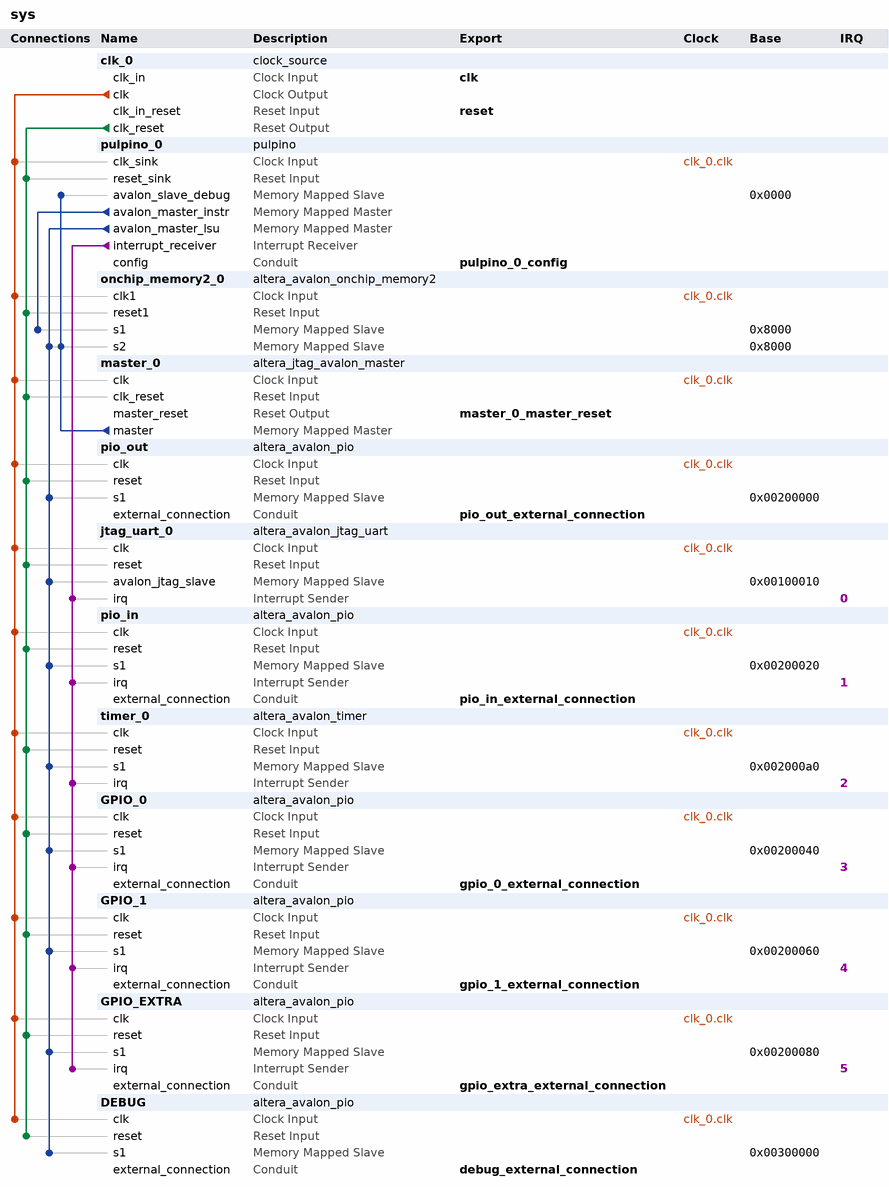
[diagram p0: system contents]
# Platform Designer (Qsys) system sys, Cyclone V 5CSEBA6U23I7
# Parameters at their usual value, and those the tool derives, are not listed.
package require -exact qsys 25.1
create_system sys
set_project_property DEVICE_FAMILY {Cyclone V}
set_project_property DEVICE 5CSEBA6U23I7

add_instance clk_0 clock_source 25.1
set_instance_parameter_value clk_0 clockFrequency 50000000

add_instance pulpino_0 pulpino 1.0
set_instance_parameter_value pulpino_0 AXI_ADDR_WIDTH 32
set_instance_parameter_value pulpino_0 AXI_DATA_WIDTH 32
set_instance_parameter_value pulpino_0 AXI_ID_MASTER_WIDTH 10
set_instance_parameter_value pulpino_0 AXI_ID_SLAVE_WIDTH 10
set_instance_parameter_value pulpino_0 AXI_USER_WIDTH 0
set_instance_parameter_value pulpino_0 RISCY_RV32F false
set_instance_parameter_value pulpino_0 USE_ZERO_RISCY true
set_instance_parameter_value pulpino_0 ZERO_RV32E false
set_instance_parameter_value pulpino_0 ZERO_RV32M true

add_instance onchip_memory2_0 altera_avalon_onchip_memory2 25.1
set_instance_parameter_value onchip_memory2_0 dataWidth 32
set_instance_parameter_value onchip_memory2_0 dualPort true
set_instance_parameter_value onchip_memory2_0 initMemContent true
set_instance_parameter_value onchip_memory2_0 memorySize 32768
set_instance_parameter_value onchip_memory2_0 singleClockOperation true

add_instance master_0 altera_jtag_avalon_master 25.1

add_instance pio_out altera_avalon_pio 25.1
set_instance_parameter_value pio_out direction Output
set_instance_parameter_value pio_out width 32

add_instance jtag_uart_0 altera_avalon_jtag_uart 25.1
set_instance_parameter_value jtag_uart_0 simInteractiveOptions NO_INTERACTIVE_WINDOWS
set_instance_parameter_value jtag_uart_0 useRegistersForReadBuffer true
set_instance_parameter_value jtag_uart_0 useRegistersForWriteBuffer true

add_instance pio_in altera_avalon_pio 25.1
set_instance_parameter_value pio_in captureEdge true
set_instance_parameter_value pio_in direction Input
set_instance_parameter_value pio_in generateIRQ true
set_instance_parameter_value pio_in irqType EDGE
set_instance_parameter_value pio_in width 32

add_instance timer_0 altera_avalon_timer 25.1
set_instance_parameter_value timer_0 period 5000
set_instance_parameter_value timer_0 periodUnits CLOCKS

add_instance GPIO_0 altera_avalon_pio 25.1
set_instance_parameter_value GPIO_0 bitClearingEdgeCapReg true
set_instance_parameter_value GPIO_0 bitModifyingOutReg true
set_instance_parameter_value GPIO_0 captureEdge true
set_instance_parameter_value GPIO_0 direction Bidir
set_instance_parameter_value GPIO_0 generateIRQ true
set_instance_parameter_value GPIO_0 irqType EDGE
set_instance_parameter_value GPIO_0 width 32

add_instance GPIO_1 altera_avalon_pio 25.1
set_instance_parameter_value GPIO_1 bitClearingEdgeCapReg true
set_instance_parameter_value GPIO_1 bitModifyingOutReg true
set_instance_parameter_value GPIO_1 captureEdge true
set_instance_parameter_value GPIO_1 direction Bidir
set_instance_parameter_value GPIO_1 generateIRQ true
set_instance_parameter_value GPIO_1 irqType EDGE
set_instance_parameter_value GPIO_1 width 32

add_instance GPIO_EXTRA altera_avalon_pio 25.1
set_instance_parameter_value GPIO_EXTRA bitClearingEdgeCapReg true
set_instance_parameter_value GPIO_EXTRA bitModifyingOutReg true
set_instance_parameter_value GPIO_EXTRA captureEdge true
set_instance_parameter_value GPIO_EXTRA direction Bidir
set_instance_parameter_value GPIO_EXTRA generateIRQ true
set_instance_parameter_value GPIO_EXTRA irqType EDGE
set_instance_parameter_value GPIO_EXTRA width 8

add_instance DEBUG altera_avalon_pio 25.1
set_instance_parameter_value DEBUG bitModifyingOutReg true
set_instance_parameter_value DEBUG direction Output
set_instance_parameter_value DEBUG width 32

# connections
add_connection clk_0.clk DEBUG.clk clock
add_connection clk_0.clk GPIO_0.clk clock
add_connection clk_0.clk GPIO_1.clk clock
add_connection clk_0.clk GPIO_EXTRA.clk clock
add_connection clk_0.clk jtag_uart_0.clk clock
add_connection clk_0.clk master_0.clk clock
add_connection clk_0.clk onchip_memory2_0.clk1 clock
add_connection clk_0.clk pio_in.clk clock
add_connection clk_0.clk pio_out.clk clock
add_connection clk_0.clk pulpino_0.clk_sink clock
add_connection clk_0.clk timer_0.clk clock
add_connection clk_0.clk_reset DEBUG.reset reset
add_connection clk_0.clk_reset GPIO_0.reset reset
add_connection clk_0.clk_reset GPIO_1.reset reset
add_connection clk_0.clk_reset GPIO_EXTRA.reset reset
add_connection clk_0.clk_reset jtag_uart_0.reset reset
add_connection clk_0.clk_reset master_0.clk_reset reset
add_connection clk_0.clk_reset onchip_memory2_0.reset1 reset
add_connection clk_0.clk_reset pio_in.reset reset
add_connection clk_0.clk_reset pio_out.reset reset
add_connection clk_0.clk_reset pulpino_0.reset_sink reset
add_connection clk_0.clk_reset timer_0.reset reset
add_connection master_0.master onchip_memory2_0.s2 avalon
set_connection_parameter_value master_0.master/onchip_memory2_0.s2 baseAddress 0x8000
add_connection master_0.master pulpino_0.avalon_slave_debug avalon
set_connection_parameter_value master_0.master/pulpino_0.avalon_slave_debug baseAddress 0x0000
add_connection pulpino_0.avalon_master_instr onchip_memory2_0.s1 avalon
set_connection_parameter_value pulpino_0.avalon_master_instr/onchip_memory2_0.s1 baseAddress 0x8000
add_connection pulpino_0.avalon_master_lsu DEBUG.s1 avalon
set_connection_parameter_value pulpino_0.avalon_master_lsu/DEBUG.s1 baseAddress 0x00300000
add_connection pulpino_0.avalon_master_lsu GPIO_0.s1 avalon
set_connection_parameter_value pulpino_0.avalon_master_lsu/GPIO_0.s1 baseAddress 0x00200040
add_connection pulpino_0.avalon_master_lsu GPIO_1.s1 avalon
set_connection_parameter_value pulpino_0.avalon_master_lsu/GPIO_1.s1 baseAddress 0x00200060
add_connection pulpino_0.avalon_master_lsu GPIO_EXTRA.s1 avalon
set_connection_parameter_value pulpino_0.avalon_master_lsu/GPIO_EXTRA.s1 baseAddress 0x00200080
add_connection pulpino_0.avalon_master_lsu jtag_uart_0.avalon_jtag_slave avalon
set_connection_parameter_value pulpino_0.avalon_master_lsu/jtag_uart_0.avalon_jtag_slave baseAddress 0x00100010
add_connection pulpino_0.avalon_master_lsu onchip_memory2_0.s2 avalon
set_connection_parameter_value pulpino_0.avalon_master_lsu/onchip_memory2_0.s2 baseAddress 0x8000
add_connection pulpino_0.avalon_master_lsu pio_in.s1 avalon
set_connection_parameter_value pulpino_0.avalon_master_lsu/pio_in.s1 baseAddress 0x00200020
add_connection pulpino_0.avalon_master_lsu pio_out.s1 avalon
set_connection_parameter_value pulpino_0.avalon_master_lsu/pio_out.s1 baseAddress 0x00200000
add_connection pulpino_0.avalon_master_lsu timer_0.s1 avalon
set_connection_parameter_value pulpino_0.avalon_master_lsu/timer_0.s1 baseAddress 0x002000a0
add_connection pulpino_0.interrupt_receiver GPIO_0.irq interrupt
set_connection_parameter_value pulpino_0.interrupt_receiver/GPIO_0.irq irqNumber 3
add_connection pulpino_0.interrupt_receiver GPIO_1.irq interrupt
set_connection_parameter_value pulpino_0.interrupt_receiver/GPIO_1.irq irqNumber 4
add_connection pulpino_0.interrupt_receiver GPIO_EXTRA.irq interrupt
set_connection_parameter_value pulpino_0.interrupt_receiver/GPIO_EXTRA.irq irqNumber 5
add_connection pulpino_0.interrupt_receiver jtag_uart_0.irq interrupt
set_connection_parameter_value pulpino_0.interrupt_receiver/jtag_uart_0.irq irqNumber 0
add_connection pulpino_0.interrupt_receiver pio_in.irq interrupt
set_connection_parameter_value pulpino_0.interrupt_receiver/pio_in.irq irqNumber 1
add_connection pulpino_0.interrupt_receiver timer_0.irq interrupt
set_connection_parameter_value pulpino_0.interrupt_receiver/timer_0.irq irqNumber 2

# exported interfaces
add_interface clk clock sink
set_interface_property clk EXPORT_OF clk_0.clk_in
add_interface debug_external_connection conduit end
set_interface_property debug_external_connection EXPORT_OF DEBUG.external_connection
add_interface gpio_0_external_connection conduit end
set_interface_property gpio_0_external_connection EXPORT_OF GPIO_0.external_connection
add_interface gpio_1_external_connection conduit end
set_interface_property gpio_1_external_connection EXPORT_OF GPIO_1.external_connection
add_interface gpio_extra_external_connection conduit end
set_interface_property gpio_extra_external_connection EXPORT_OF GPIO_EXTRA.external_connection
add_interface master_0_master_reset reset source
set_interface_property master_0_master_reset EXPORT_OF master_0.master_reset
add_interface pio_in_external_connection conduit end
set_interface_property pio_in_external_connection EXPORT_OF pio_in.external_connection
add_interface pio_out_external_connection conduit end
set_interface_property pio_out_external_connection EXPORT_OF pio_out.external_connection
add_interface pulpino_0_config conduit end
set_interface_property pulpino_0_config EXPORT_OF pulpino_0.config
add_interface reset reset sink
set_interface_property reset EXPORT_OF clk_0.clk_in_reset

set_interconnect_requirement {$system} qsys_mm.clockCrossingAdapter HANDSHAKE
set_interconnect_requirement {$system} qsys_mm.enableEccProtection FALSE
set_interconnect_requirement {$system} qsys_mm.insertDefaultSlave FALSE
set_interconnect_requirement {$system} qsys_mm.maxAdditionalLatency 1

save_system sys.qsys
